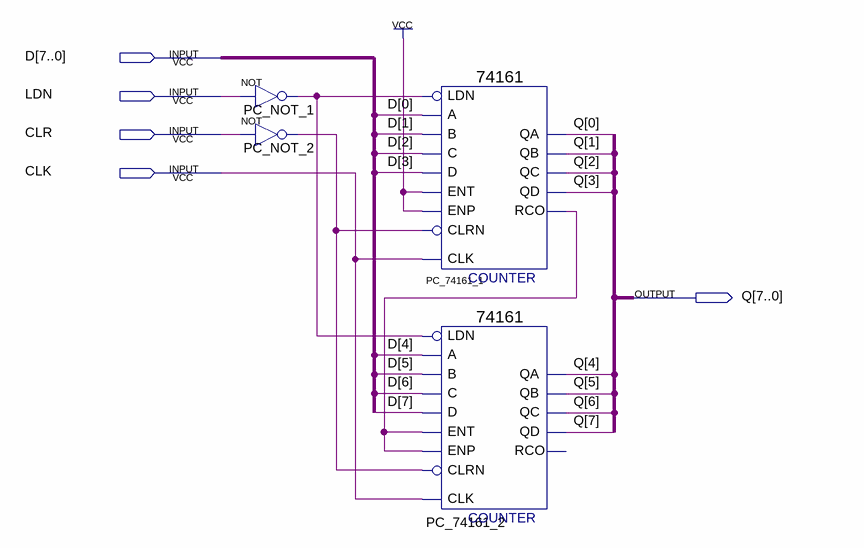
[diagram p0: schematic sheet]
// Quartus schematic PC.bdf as structural Verilog: 4 symbols, 5 pins
module PC (
  input  [7:0] D,
  input  LDN,
  input  CLR,
  input  CLK,
  output [7:0] Q
);

  wire PC_74161_1_rco, PC_NOT_1_out, PC_NOT_2_out;

  not PC_NOT_1 (PC_NOT_1_out, LDN);
  not PC_NOT_2 (PC_NOT_2_out, CLR);
  \74161  PC_74161_1 (
    .CLRN(PC_NOT_2_out), .CLK(CLK), .ENP(1'b1), .LDN(PC_NOT_1_out), .A(D[0]), .D(D[3]), .ENT(1'b1), .B(D[1]),
    .C(D[2]), .QD(Q[3]), .QC(Q[2]), .QB(Q[1]), .QA(Q[0]), .RCO(PC_74161_1_rco));
  \74161  PC_74161_2 (
    .CLRN(PC_NOT_2_out), .CLK(CLK), .ENP(PC_74161_1_rco), .LDN(PC_NOT_1_out), .A(D[4]), .D(D[7]),
    .ENT(PC_74161_1_rco), .B(D[5]), .C(D[6]), .QD(Q[7]), .QC(Q[6]), .QB(Q[5]), .QA(Q[4]));  // open: RCO
endmodule
